# EAGLE design Sensor-touch (EAGLE 6.5.0)
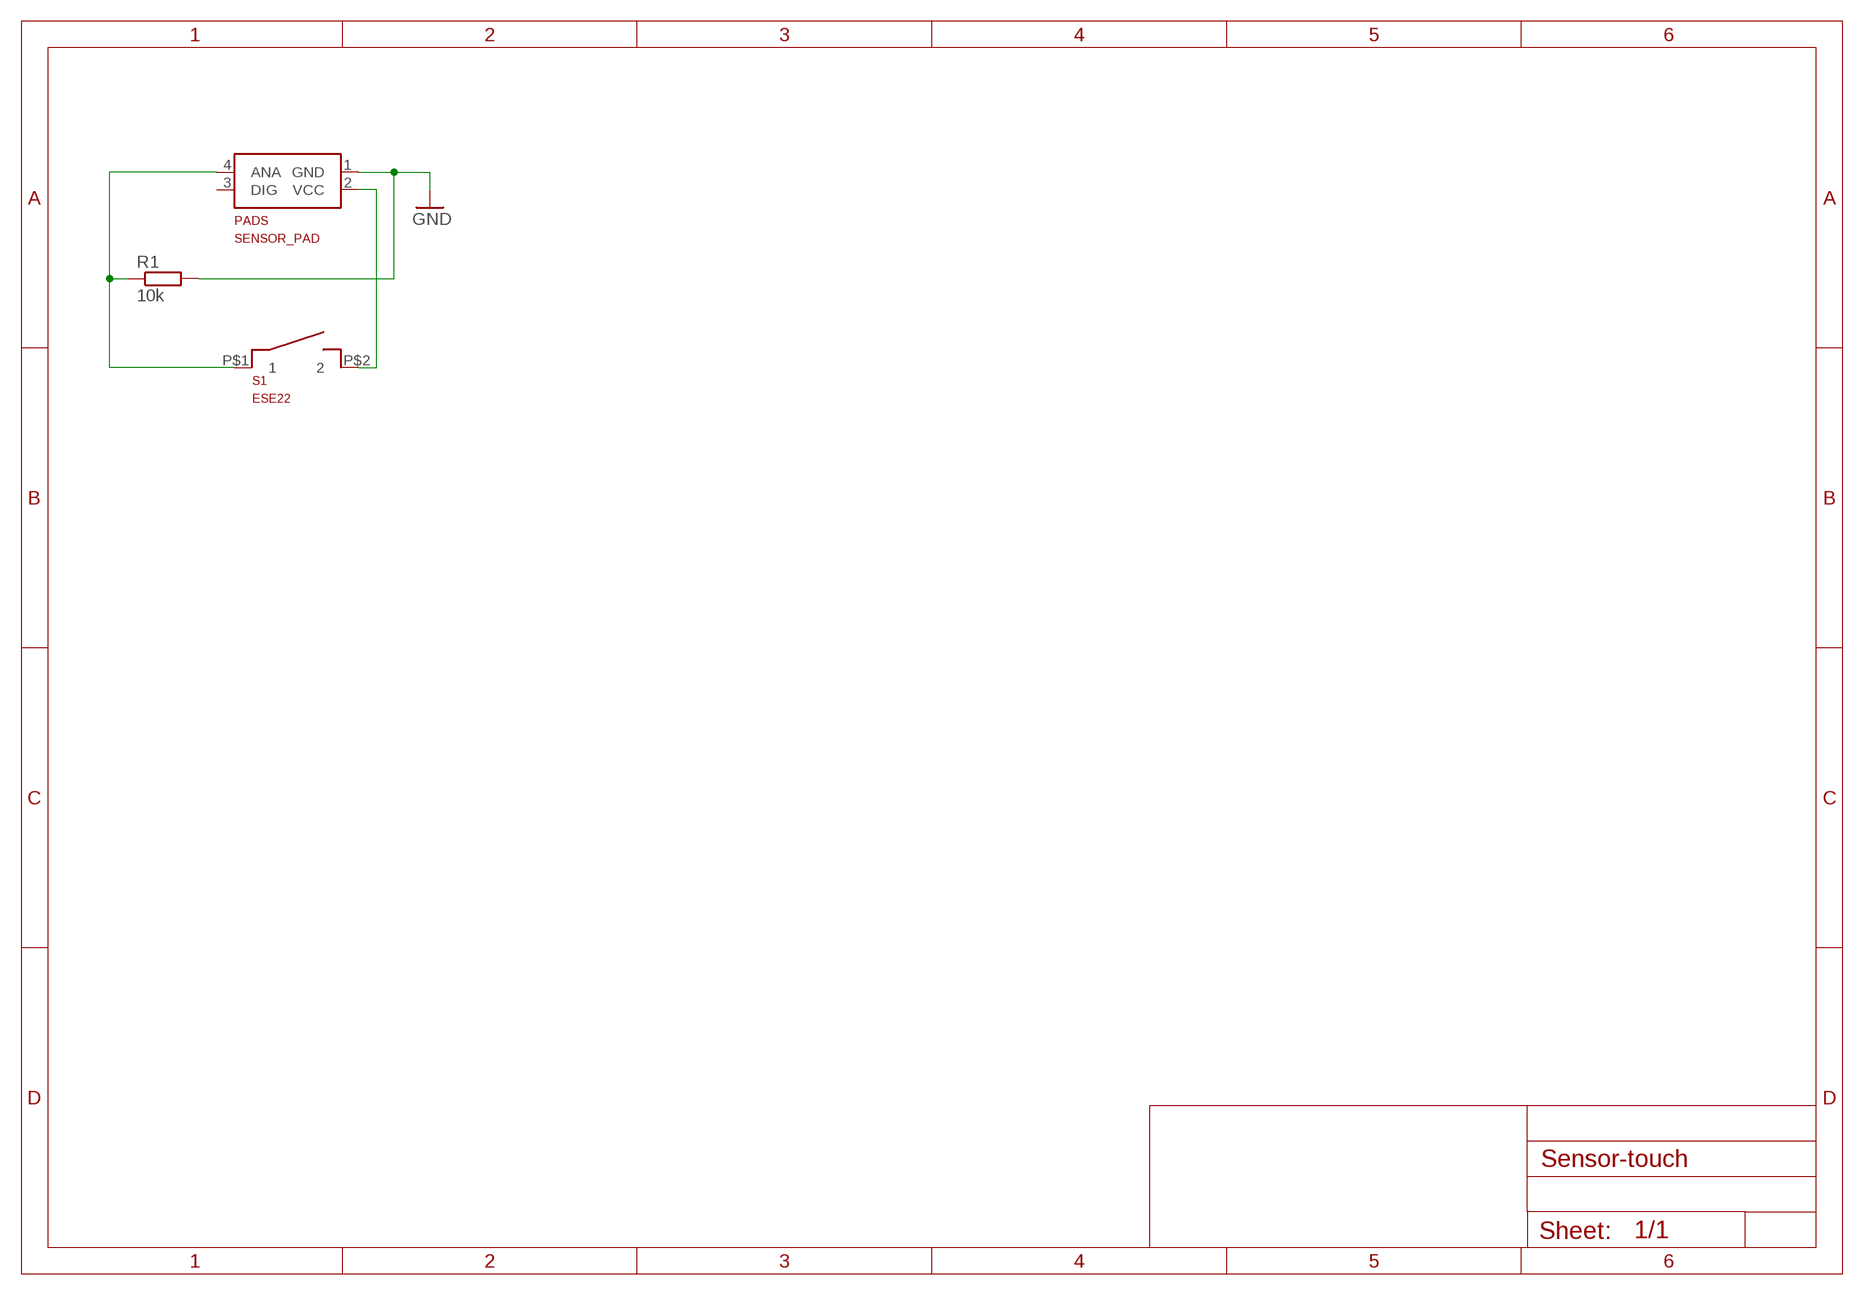
[diagram p0: schematic, sheet 1]

## Parts
PADS  SENSOR_PAD  [SENSOR_PAD]
R1  10k  R-EU_R0805  [R0805]
S1  ESE22  [ESE22]

## Nets
GND: PADS.1(GND) R1.2
N$1: PADS.4(ANA) R1.1 S1.P$1
N$4: PADS.2(VCC) S1.P$2
Unconnected: PADS.3(DIG)

## Library data of the parts
PADS = sduino:SENSOR_PAD; OC_FARNELL: unknown
R1 = resistor:R-EU_: RESISTOR, European symbol; MF: YAGEO (PHYCOMP); MPN: RC0805FR-0710KL; OC_FARNELL: 9237755
S1 = sduino:ESE22; MF: PANASONIC ELECTRONIC COMPONENTS; MPN: ESE-22MH24; OC_FARNELL: 2459516

## Board
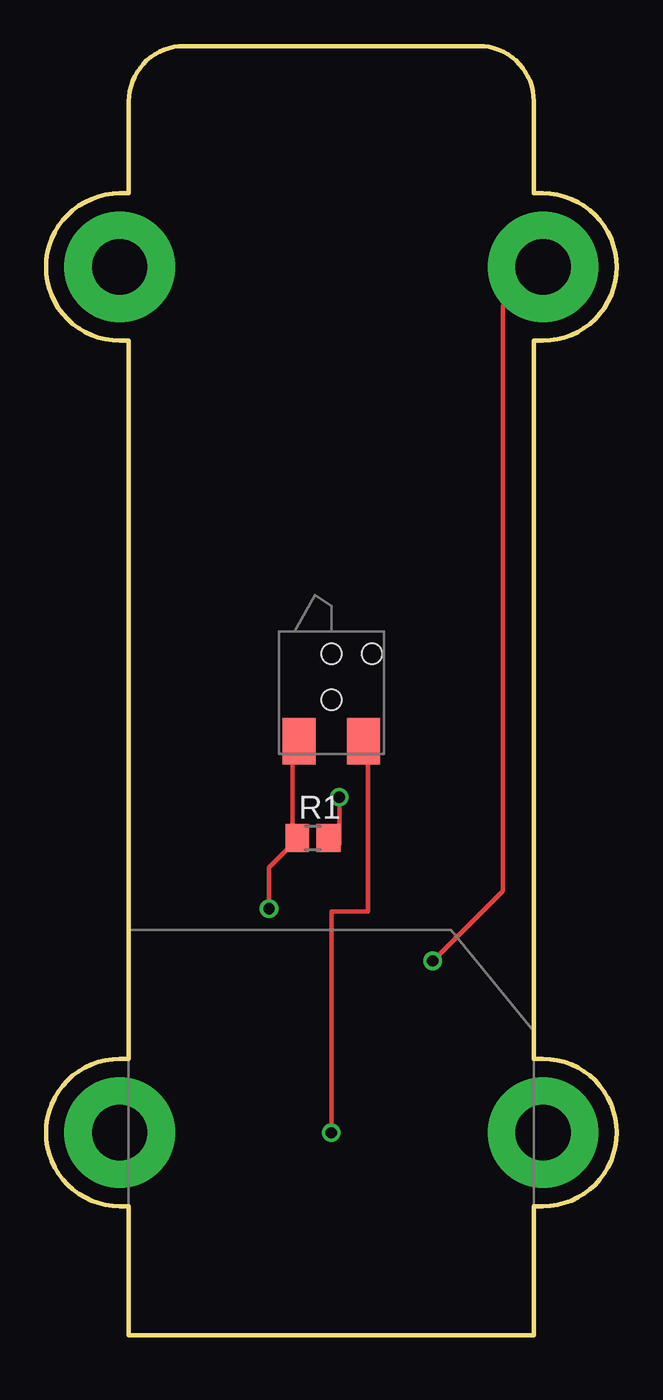
[diagram p1: board, top side]
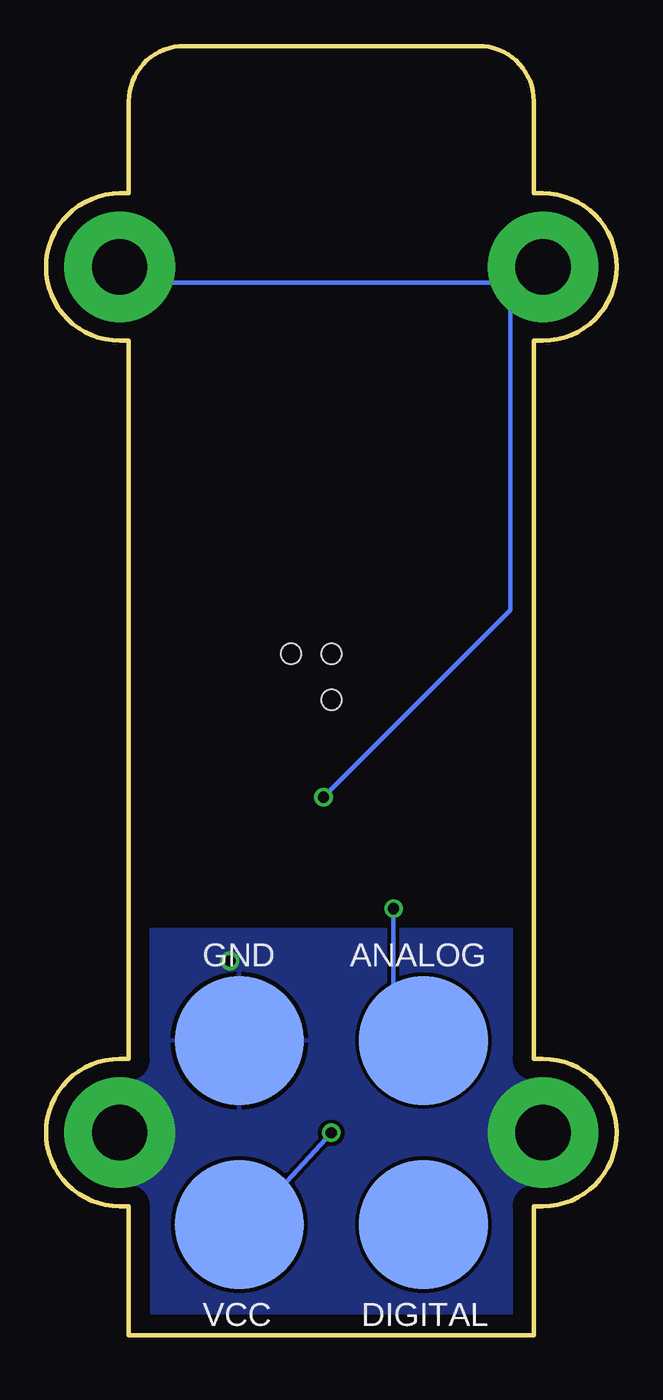
[diagram p2: board, bottom side, seen from below]

Size 31 x 70 mm. Coordinates in mm from the lower left corner, seen from the top.
Outline: 26.5,0 4.5,0 4.5,7 4,7 arc-180 4,15 4.5,15 4.5,54 4,54 arc-180 4,62 4.5,62 4.5,67 arc-90 7.5,70 23.5,70 arc-90 26.5,67 26.5,62 27,62 arc-180 27,54 26.5,54 26.5,15 27,15 arc-180 27,7 26.5,7 26.5,0
Copper layers (1*16): Top 0.035mm / dielectric 1.5mm / Bottom 0.035mm
Design rules "default *": minimum track width 10mil, minimum drill 24mil, track to track 8mil, track to pad 8mil, pad to pad 8mil, via to via 8mil, smd to smd 8mil, copper to edge 40mil, drill to drill 8mil, minimum pad ring 10mil, minimum via ring 8mil, stop-mask expansion 4mil, vias tented up to drill 50mil, thermal gap 10mil

### Footprints (pad centres in the part's own frame; a part is rotated, then mirrored left to right if it is on the bottom)
SENSOR_PAD = smd 7 x 7 bottom: 1 16,16; 2 16,6; 3 6,6; 4 6,16
R0805 = smd 1.3 x 1.5: 1 -0.85,0; 2 0.85,0
ESE22 = smd 1.8 x 2.5: P$1 -1.75,-4.75; P$2 1.75,-4.75 | hole 1.1: 0,-2.5; 0,0; 2.2,0

### Placement (x,y rotation side)
PADS  4.5,0 0 top
R1  14.5,27 0 top
S1  15.5,37 0 top

### Tracks (layer width: path | path; a pad name or v marks a point on that pad's centre or on a via)
GND  (via drill 0.61, 3 pad 6)
  Top 0.254: v15.93,29.21 15.93,26.67 R1.2 | v21.01,20.32 24.82,24.13 24.82,55.88 26.09,57.15 v27,58
  Bottom 0.254: v15.93,29.21 5.77,39.37 5.77,57.15 | 5.77,57.15 4.5,57.15 v4,58 5.77,57.15 | 5.77,57.15 26.09,57.15 v27,58
  other vias: 4,11 27,11
  pour Bottom: -1.5,22 -1.5,-2 33.5,-2 33.5,22
N$1  (via drill 0.61)
  Top 0.254: 13.39,26.67 13.39,31.75 S1.P$1 | 13.39,26.67 12.12,25.4 v12.12,23.16 | 13.39,26.67 R1.1
  Bottom 0.254: PADS.4 12.12,16 v12.12,23.16
N$4  (via drill 0.61)
  Top 0.254: v15.5,10.99 15.5,23 17.5,23 17.5,31.75 17.2,31.75 S1.P$2
  Bottom 0.254: v15.5,10.99 19.74,6.35 PADS.2